# Altium schematic sheet HVBlocks.SchDoc
size A
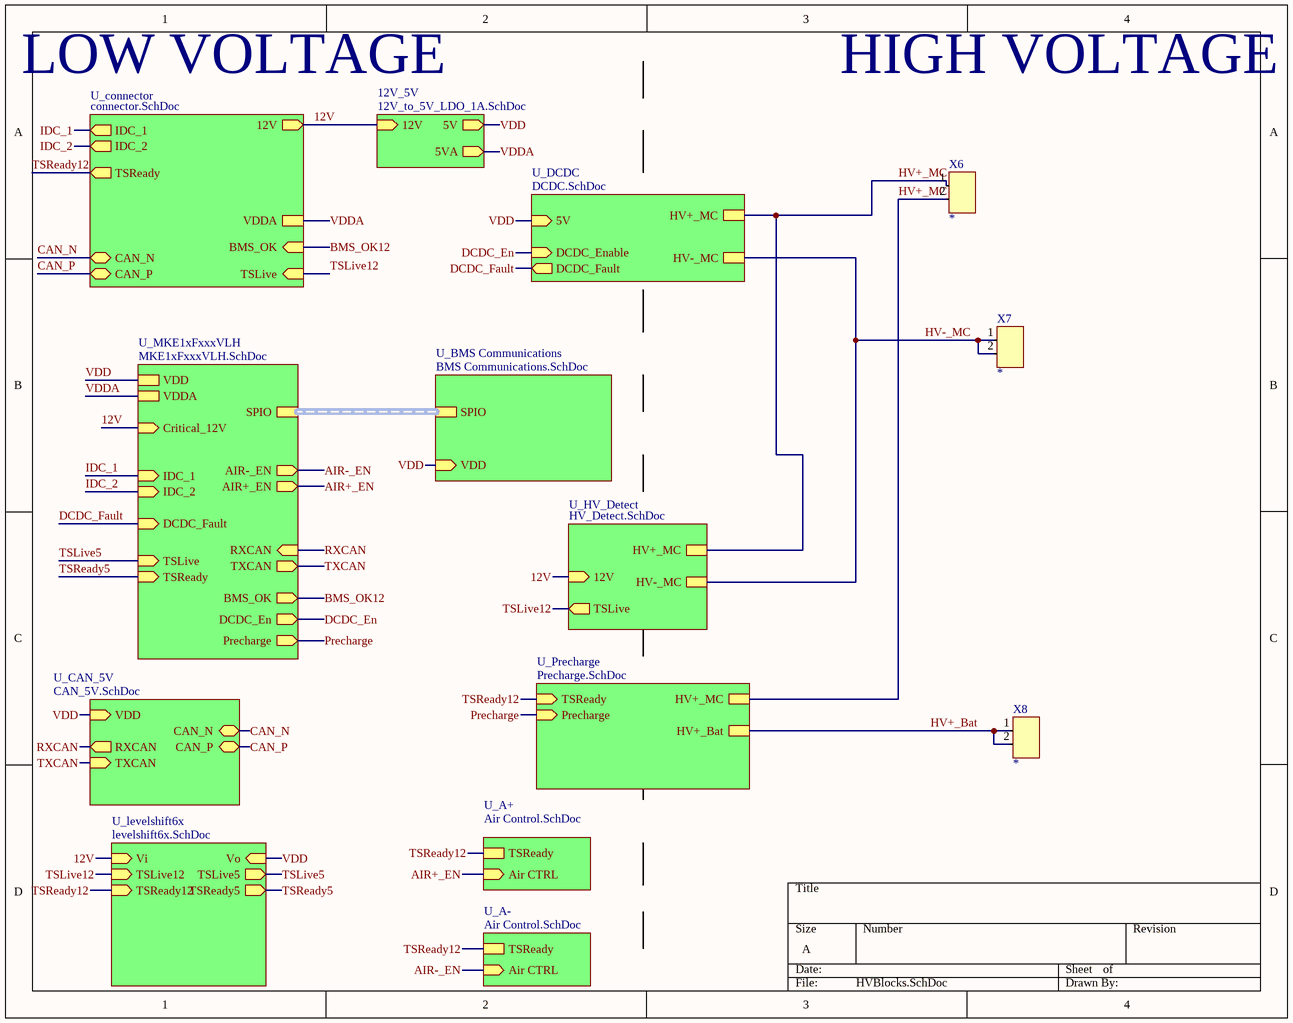
[diagram p0: HVBlocks.SchDoc]

## Parts
X6  *  [CONN 43650-0200 MOLEX 2PIN]
X7  *  [CONN 43650-0200 MOLEX 2PIN]
X8  *  [CONN 43650-0200 MOLEX 2PIN]

## Sub-sheets
12V_5V = 12V_to_5V_LDO_1A.SchDoc: 12V (in), 5V (out), 5VA (out)
U_A+ = Air Control.SchDoc: TSReady, Air CTRL (in)
U_A- = Air Control.SchDoc: TSReady, Air CTRL (in)
U_BMS Communications = BMS Communications.SchDoc: SPIO (harness *), VDD (in)
U_CAN_5V = CAN_5V.SchDoc: TXCAN (in), RXCAN (out), CAN_N (bidir), CAN_P (bidir), VDD (in)
U_connector = connector.SchDoc: 12V (out), TSLive (in), IDC_1 (out), IDC_2 (out), VDDA, CAN_N (bidir), CAN_P (bidir), TSReady (out), BMS_OK (in)
U_DCDC = DCDC.SchDoc: DCDC_Enable (in), HV+_MC, HV-_MC, DCDC_Fault (out), 5V (in)
U_HV_Detect = HV_Detect.SchDoc: HV+_MC, HV-_MC, 12V (in), TSLive (out)
U_levelshift6x = levelshift6x.SchDoc: Vi (in), TSLive12 (in), TSReady12 (in), TSLive5 (out), TSReady5 (out), Vo (in)
U_MKE1xFxxxVLH = MKE1xFxxxVLH.SchDoc: VDD, SPIO (harness *), RXCAN (in), TXCAN (out), AIR-_EN (out), AIR+_EN (out), TSLive (in), VDDA, IDC_1 (in), IDC_2 (in), DCDC_Fault (in), DCDC_En (out), Precharge (out), TSReady (in), BMS_OK (out), Critical_12V (in)
U_Precharge = Precharge.SchDoc: TSReady (in), Precharge (in), HV+_MC, HV+_Bat

## Nets
12V: sheet U_MKE1xFxxxVLH/Critical_12V, sheet U_connector/12V, sheet 12V_5V/12V, sheet U_levelshift6x/Vi, sheet U_HV_Detect/12V
AIR+_EN: sheet U_A+/Air CTRL, sheet U_MKE1xFxxxVLH/AIR+_EN
AIR-_EN: sheet U_A-/Air CTRL, sheet U_MKE1xFxxxVLH/AIR-_EN
BMS_OK12: sheet U_MKE1xFxxxVLH/BMS_OK, sheet U_connector/BMS_OK
CAN_N: sheet U_connector/CAN_N, sheet U_CAN_5V/CAN_N
CAN_P: sheet U_connector/CAN_P, sheet U_CAN_5V/CAN_P
DCDC_En: sheet U_MKE1xFxxxVLH/DCDC_En, sheet U_DCDC/DCDC_Enable
DCDC_Fault: sheet U_MKE1xFxxxVLH/DCDC_Fault, sheet U_DCDC/DCDC_Fault
HV+_Bat: X8.1 X8.2 ; sheet U_Precharge/HV+_Bat
HV+_MC: X6.1 X6.2 ; sheet U_DCDC/HV+_MC, sheet U_HV_Detect/HV+_MC, sheet U_Precharge/HV+_MC
HV-_MC: X7.1 X7.2 ; sheet U_DCDC/HV-_MC, sheet U_HV_Detect/HV-_MC
IDC_1: sheet U_MKE1xFxxxVLH/IDC_1, sheet U_connector/IDC_1
IDC_2: sheet U_MKE1xFxxxVLH/IDC_2, sheet U_connector/IDC_2
Precharge: sheet U_MKE1xFxxxVLH/Precharge, sheet U_Precharge/Precharge
RXCAN: sheet U_MKE1xFxxxVLH/RXCAN, sheet U_CAN_5V/RXCAN
TSLive5: sheet U_MKE1xFxxxVLH/TSLive, sheet U_levelshift6x/TSLive5
TSLive12: sheet U_connector/TSLive, sheet U_levelshift6x/TSLive12, sheet U_HV_Detect/TSLive
TSReady5: sheet U_MKE1xFxxxVLH/TSReady, sheet U_levelshift6x/TSReady5
TSReady12: sheet U_A-/TSReady, sheet U_A+/TSReady, sheet U_connector/TSReady, sheet U_levelshift6x/TSReady12, sheet U_Precharge/TSReady
TXCAN: sheet U_MKE1xFxxxVLH/TXCAN, sheet U_CAN_5V/TXCAN
VDD: sheet U_MKE1xFxxxVLH/VDD, sheet U_BMS Communications/VDD, sheet 12V_5V/5V, sheet U_levelshift6x/Vo, sheet U_CAN_5V/VDD, sheet U_DCDC/5V
VDDA: sheet U_MKE1xFxxxVLH/VDDA, sheet U_connector/VDDA, sheet 12V_5V/5VA

## Buses and harness runs
harness sheet U_BMS Communications/SPIO = sheet U_MKE1xFxxxVLH/SPIO

## Notes on the sheet
- LOW VOLTAGE
- HIGH VOLTAGE

## Library data of the parts
X6-X8 = 9: Molex 43650_0200; id: 9; name: 0436500200; numcontacts: 2; numrows: 1; pitch: 3 mm; MfrPartNo: *; quantity: 0; link: https://www.digikey.com/product-detail/en/molex-llc/0436500200/WM1860-ND/268989